# Altium schematic sheet GPS_Altimetro_BoosterPack.SchDoc
size A4
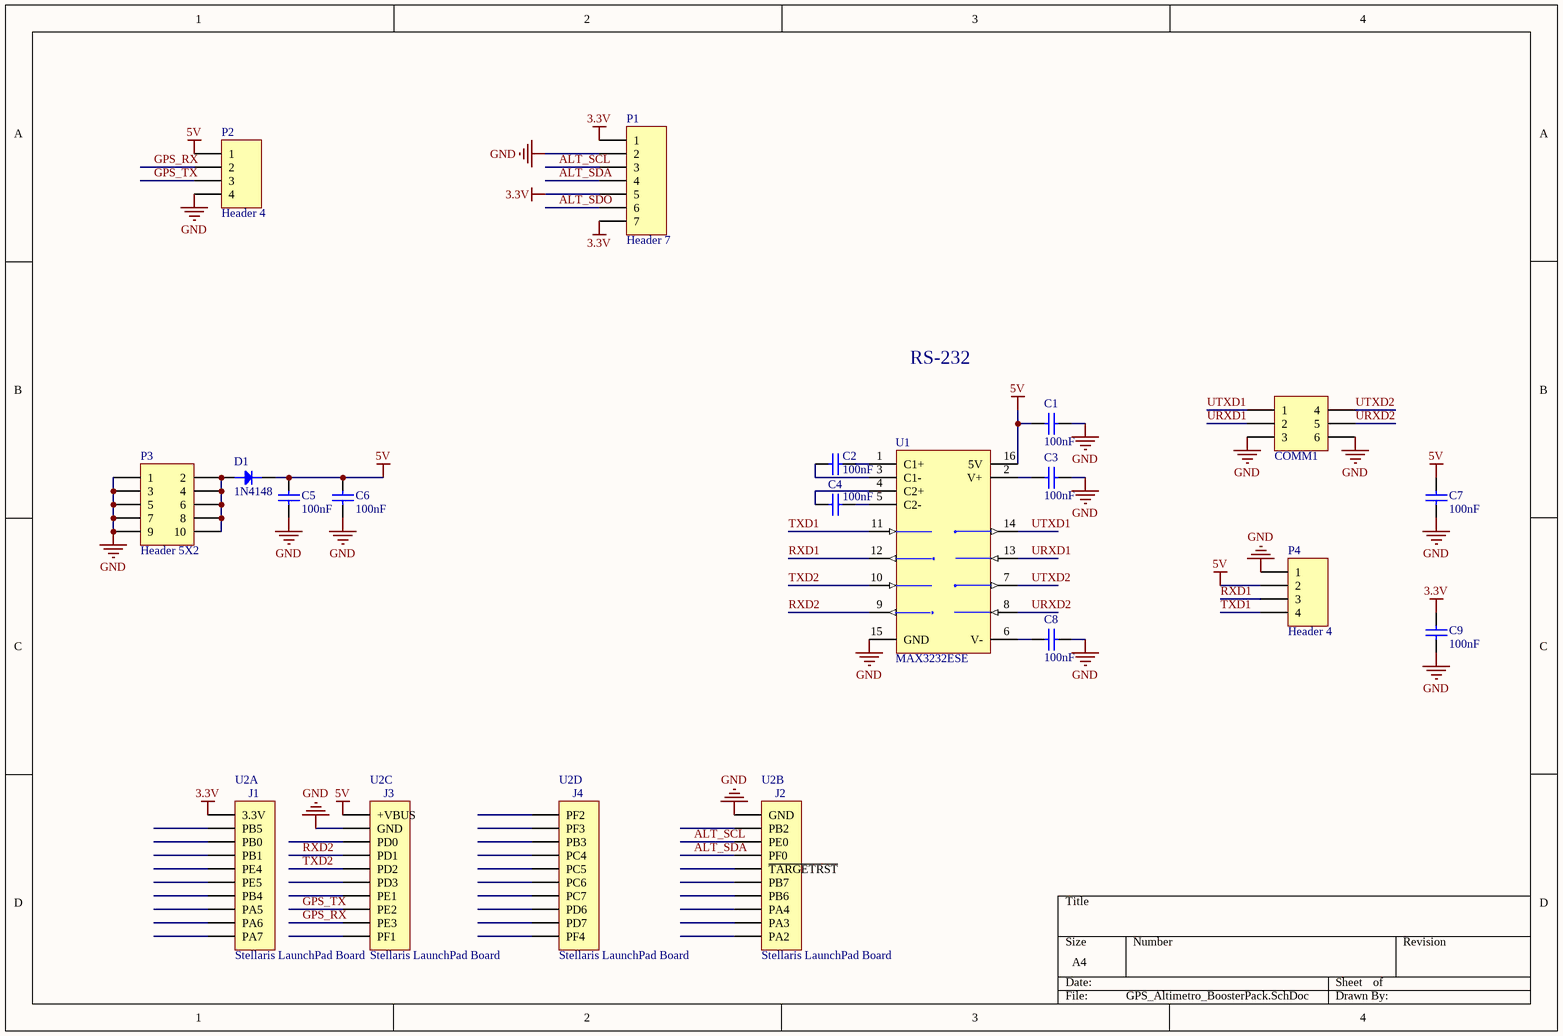
[diagram p0: GPS_Altimetro_BoosterPack.SchDoc]

## Parts
C1  value 100nF  [0805_CAP]  (hidden comment: Capacitor)
C2  value 100nF  [0805_CAP]  (hidden comment: Capacitor)
C3  value 100nF  [0805_CAP]  (hidden comment: Capacitor)
C4  value 100nF  [0805_CAP]  (hidden comment: Capacitor)
C5  value 100nF  [0805_CAP]  (hidden comment: Capacitor)
C6  value 100nF  [0805_CAP]  (hidden comment: Capacitor)
C7  value 100nF  [0805_CAP]  (hidden comment: Capacitor)
C8  value 100nF  [0805_CAP]  (hidden comment: Capacitor)
C9  value 100nF  [0805_CAP]  (hidden comment: Capacitor)
COMM1  AP_COMM  [HDR2X3_CEN]  (value not drawn)
D1  1N4148  [1N4148SMD]
P1  Header 7  [HDR1X7]
P2  Header 4  [HDR1X4]
P3  Header 5X2  [HDR2X5]
P4  Header 4  [HDR1X4]
U1  MAX3232ESE  [SOIC127P602-16BN]
U2  Stellaris LaunchPad Board  [LaunchPad]  (parts A,B,C,D of 4)

## Nets
3.3V: C9.1 P1.1 P1.5 P1.7 U2.1(3.3V)
5V: C1.2 C5.1 C6.1 C7.1 D1.2(K) P2.1 P4.2 U1.16(5V) U2.21(+VBUS)
GND: C1.1 C3.1 C5.2 C6.2 C7.2 C8.1 C9.2 COMM1.3 COMM1.6 P1.2 P2.4 P3.1 P3.3 P3.5 P3.7 P3.9 P4.1 U1.15(GND) U2.11(GND) U2.22(GND)
ALT_SCL: P1.3 U2.13(PE0)
ALT_SDA: P1.4 U2.14(PF0)
ALT_SDO: P1.6
GPS_RX: P2.2 U2.29(PE3)
GPS_TX: P2.3 U2.28(PE2)
RXD1: P4.3 U1.12(R1OUT)
RXD2: U1.9(R2OUT) U2.24(PD1)
TXD1: P4.4 U1.11(T1IN)
TXD2: U1.10(T2IN) U2.25(PD2)
URXD1: COMM1.2 U1.13(R1IN)
URXD2: COMM1.5 U1.8(R2IN)
UTXD1: COMM1.1 U1.14(T1OUT)
UTXD2: COMM1.4 U1.7(T2OUT)
NetC2_1: C2.1 U1.1(C1+)
NetC2_2: C2.2 U1.3(C1-)
NetC3_2: C3.2 U1.2(V+)
NetC4_1: C4.1 U1.5(C2-)
NetC4_2: C4.2 U1.4(C2+)
NetC8_2: C8.2 U1.6(V-)
NetD1_1: D1.1(A) P3.2 P3.4 P3.6 P3.8 P3.10

Not connected (* = marked no-connect by the designer): U2 2(PB5) 3(PB0) 4(PB1) 5(PE4) 6(PE5) 7(PB4) 8(PA5) 9(PA6) 10(PA7) 12(PB2) 15(~{TARGETRST}) 16(PB7) 17(PB6) 18(PA4) 19(PA3) 20(PA2) 23(PD0) 26(PD3) 27(PE1) 30(PF1) 31(PF2) 32(PF3) 33(PB3) 34(PC4) 35(PC5) 36(PC6) 37(PC7) 38(PD6) 39(PD7) 40(PF4)

## Notes on the sheet
- RS-232
- (in symbol Stellaris LaunchPad Board, part A) J1
- (in symbol Stellaris LaunchPad Board, part B) J2
- (in symbol Stellaris LaunchPad Board, part C) J3
- (in symbol Stellaris LaunchPad Board, part D) J4

## Library data of the parts
C1-C9 = Cap
COMM1 = AP_COMM: Header, 3-Pin, Dual row; LatestRevisionDate: 17-Jul-2002; LatestRevisionNote: Re-released for DXP Platform.; Publisher: Altium Limited
P1 = Header 7: Header, 7-Pin; LatestRevisionDate: 17-Jul-2002; LatestRevisionNote: Re-released for DXP Platform.; Publisher: Altium Limited
P2 P4 = Header 4: Header, 4-Pin; LatestRevisionDate: 17-Jul-2002; LatestRevisionNote: Re-released for DXP Platform.; Publisher: Altium Limited
P3 = Header 5X2: Header, 5-Pin, Dual row; LatestRevisionDate: 17-Jul-2002; LatestRevisionNote: Re-released for DXP Platform.; Publisher: Altium Limited
U1 = MAX3232ESE+
U2 = Stellaris LaunchPad Board: LatestRevisionDate: 17-Jul-2002; LatestRevisionNote: Re-released for DXP Platform.; Publisher: Altium Limited